# EAGLE design SN74AHC1G09 Breakout Board (EAGLE 9.1.3)
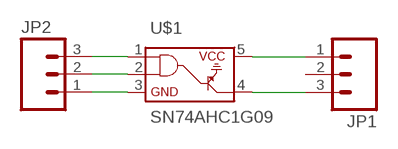
[diagram p0: schematic, sheet 1]

## Parts
JP1  M03  [1X03]
JP2  M03  [1X03]
U$1  SN74AHC1G09  [SOT-23-5]

## Nets
N$1: JP2.3 U$1.1
N$2: JP2.2 U$1.2
N$3: JP2.1 U$1.3
N$4: JP1.1 U$1.5
N$5: JP1.3 U$1.4
Unconnected: JP1.2

## Library data of the parts
JP1 JP2 = HyTechDevices:M03: Standard 3-pin 0.1" header.
U$1 = HyTechDevices:SN74AHC1G09: TI SN74AHC1G09 Single 2–Input Positive-AND Gate With Open-Drain Output Datasheet <http://www.ti.com/lit/ds/symlink/sn74ahc1g09.pdf>

## Board
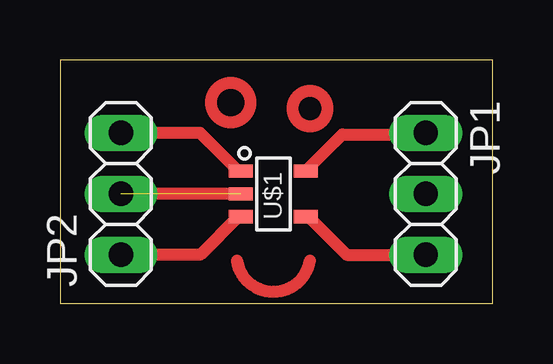
[diagram p1: board, top side]

Size 18.03 x 10.16 mm. Coordinates in mm from the lower left corner, seen from the top.
Outline: 0,0 18.03,0 18.03,10.16 0,10.16 0,0
Copper layers (1*16): Top 0.035mm / dielectric 1.5mm / Bottom 0.035mm
Design rules "default": minimum track width 6mil, minimum drill 0.35mm, track to track 6mil, track to pad 6mil, pad to pad 6mil, via to via 6mil, smd to smd 6mil, copper to edge 40mil, drill to drill 6mil, minimum pad ring 10mil, minimum via ring 8mil, stop-mask expansion 4mil, vias tented up to drill 0mil, thermal gap 10mil

### Footprints (pad centres in the part's own frame; a part is rotated, then mirrored left to right if it is on the bottom)
1X03 = drill 1.016 long: 1 -2.54,0; 2 0,0; 3 2.54,0
SOT-23-5 = smd 1 x 0.55: 1 -1.35,0.95; 2 -1.35,0; 3 -1.35,-0.95; 4 1.35,-0.95; 5 1.35,0.95

### Placement (x,y rotation side)
JP1  15.24,4.57 270 top
JP2  2.54,4.57 90 top
U$1  8.89,4.57 0 top

### Tracks (layer width: path | path; a pad name or v marks a point on that pad's centre or on a via)
N$1
  Top 0.508: U$1.1 7.43,5.52 5.84,7.11 JP2.3
N$2  (1 unrouted)
  Top 0.508: U$1.2 JP2.2
N$3
  Top 0.508: U$1.3 7.43,3.62 5.84,2.03 JP2.1
N$4
  Top 0.508: JP1.1 15.17,7.05 11.76,7.05 U$1.5
N$5
  Top 0.508: U$1.4 10.35,3.62 11.94,2.03 JP1.3
N$6
  Top 0.508: 7.37,1.78 arc161 10.41,1.78
(copper drawn outside any net)
  shapes: Top circle x2